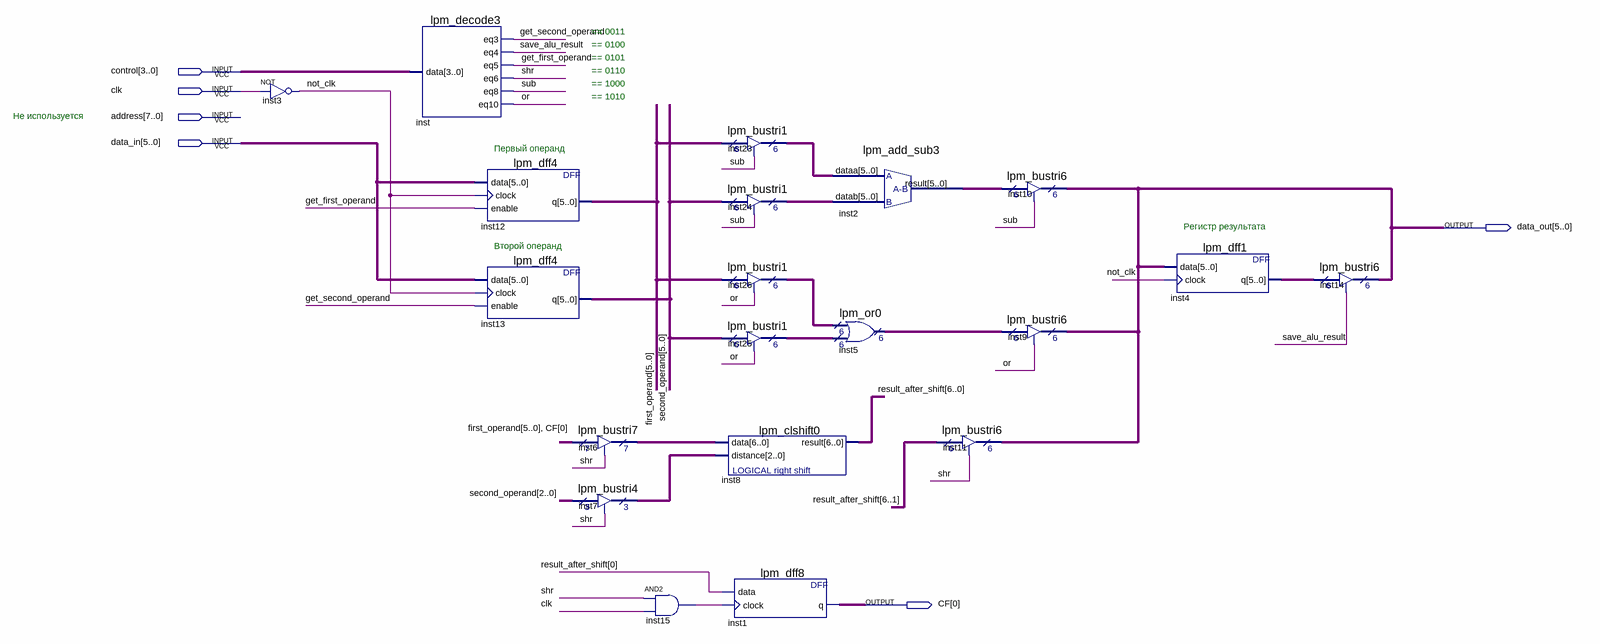
[diagram p0: schematic sheet]
// Quartus schematic ALU_block.bdf as structural Verilog: 20 symbols, 6 pins
module ALU_block (
  input  [3:0] control,
  input  clk,
  input  [7:0] address,
  input  [5:0] data_in,
  output [5:0] data_out,
  output [0:0] CF
);

  wire get_first_operand, get_second_operand, inst15_out, not_clk, \or , save_alu_result, shr, sub;
  wire [2:0] inst7_tridata;
  wire [5:0] first_operand, inst2_result, inst4_q, inst5_result, inst23_tridata, inst24_tridata,
       inst25_tridata, inst26_tridata, second_operand;
  wire [6:0] inst6_tridata, result_after_shift;

  not inst3 (not_clk, clk);
  lpm_decode3 inst (
    .data(control), .eq3(get_second_operand), .eq4(save_alu_result), .eq5(get_first_operand), .eq6(shr),
    .eq8(sub), .eq10(\or ));
  lpm_dff4 inst12 (.data(data_in), .clock(not_clk), .enable(get_first_operand), .q(first_operand));
  lpm_dff4 inst13 (.data(data_in), .clock(not_clk), .enable(get_second_operand), .q(second_operand));
  lpm_bustri7 inst6 (.enabledt(shr), .data({first_operand, CF[0]}), .tridata(inst6_tridata));
  lpm_bustri4 inst7 (.enabledt(shr), .data(second_operand[2:0]), .tridata(inst7_tridata));
  and inst15 (inst15_out, shr, clk);
  lpm_bustri1 inst23 (.enabledt(sub), .data(first_operand), .tridata(inst23_tridata));
  lpm_bustri1 inst24 (.enabledt(sub), .data(second_operand), .tridata(inst24_tridata));
  lpm_bustri1 inst26 (.enabledt(\or ), .data(first_operand), .tridata(inst26_tridata));
  lpm_bustri1 inst25 (.enabledt(\or ), .data(second_operand), .tridata(inst25_tridata));
  lpm_clshift0 inst8 (.data(inst6_tridata), .distance(inst7_tridata), .result(result_after_shift));
  lpm_dff8 inst1 (.data(result_after_shift[0]), .clock(inst15_out), .q(CF[0]));
  lpm_add_sub3 inst2 (.dataa(inst23_tridata), .datab(inst24_tridata), .result(inst2_result));
  lpm_or0 inst5 (.data0x(inst26_tridata), .data1x(inst25_tridata), .result(inst5_result));
  lpm_bustri6 inst11 (.enabledt(shr), .data(result_after_shift[6:1]), .tridata(data_out));
  lpm_bustri6 inst10 (.enabledt(sub), .data(inst2_result), .tridata(data_out));
  lpm_bustri6 inst9 (.enabledt(\or ), .data(inst5_result), .tridata(data_out));
  lpm_dff1 inst4 (.data(data_out), .clock(not_clk), .q(inst4_q));
  lpm_bustri6 inst14 (.enabledt(save_alu_result), .data(inst4_q), .tridata(data_out));

  // Notes on the sheet:
  //   == 0011
  //   == 0100
  //   == 0101
  //   == 0110
  //   == 1000
  //   == 1010
  //   Не используется
  //   Первый операнд
  //   Регистр результата
  //   Второй операнд
endmodule
